# Altium schematic sheet Schema2_bakplan_Lynx.SchDoc
size B
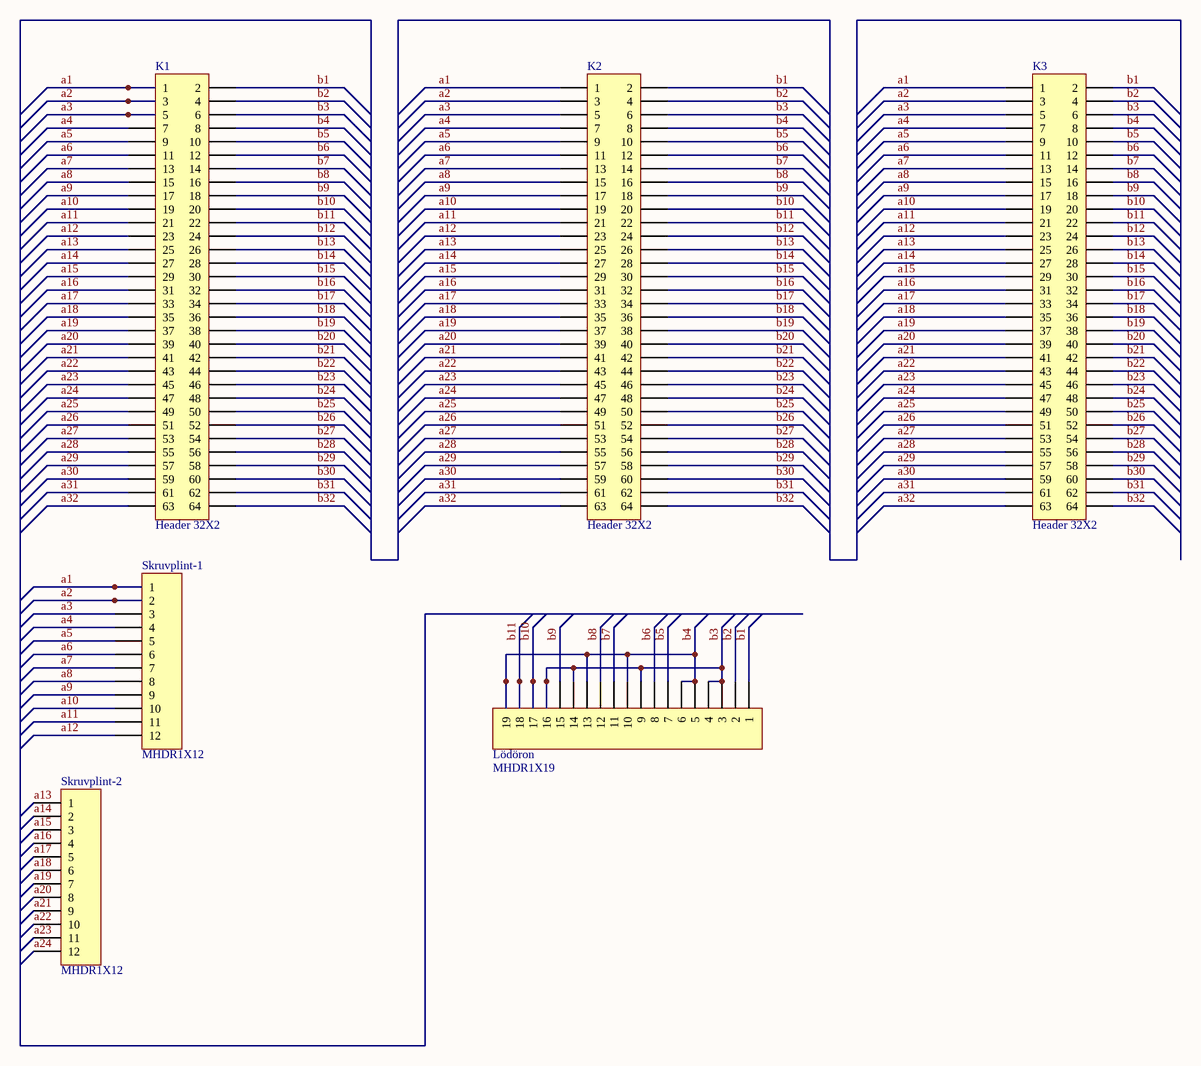
[diagram p0: Schema2_bakplan_Lynx.SchDoc]

## Parts
K1  Header 32X2  [DIN41612_EuropadonB64_Hyls]
K2  Header 32X2  [DIN41612_EuropadonB64_Hyls]
K3  Header 32X2  [DIN41612_EuropadonB64_Hyls]
Lödöron  MHDR1X19  [Lödöron_19]
Skruvplint-1  MHDR1X12  [Plint12]
Skruvplint-2  MHDR1X12  [Plint12]

## Nets
a1: K1.1 K2.1 K3.1 Skruvplint-1.1
a2: K1.3 K2.3 K3.3 Skruvplint-1.2
a3: K1.5 K2.5 K3.5 Skruvplint-1.3
a4: K1.7 K2.7 K3.7 Skruvplint-1.4
a5: K1.9 K2.9 K3.9 Skruvplint-1.5
a6: K1.11 K2.11 K3.11 Skruvplint-1.6
a7: K1.13 K2.13 K3.13 Skruvplint-1.7
a8: K1.15 K2.15 K3.15 Skruvplint-1.8
a9: K1.17 K2.17 K3.17 Skruvplint-1.9
a10: K1.19 K2.19 K3.19 Skruvplint-1.10
a11: K1.21 K2.21 K3.21 Skruvplint-1.11
a12: K1.23 K2.23 K3.23 Skruvplint-1.12
a13: K1.25 K2.25 K3.25 Skruvplint-2.1
a14: K1.27 K2.27 K3.27 Skruvplint-2.2
a15: K1.29 K2.29 K3.29 Skruvplint-2.3
a16: K1.31 K2.31 K3.31 Skruvplint-2.4
a17: K1.33 K2.33 K3.33 Skruvplint-2.5
a18: K1.35 K2.35 K3.35 Skruvplint-2.6
a19: K1.37 K2.37 K3.37 Skruvplint-2.7
a20: K1.39 K2.39 K3.39 Skruvplint-2.8
a21: K1.41 K2.41 K3.41 Skruvplint-2.9
a22: K1.43 K2.43 K3.43 Skruvplint-2.10
a23: K1.45 K2.45 K3.45 Skruvplint-2.11
a24: K1.47 K2.47 K3.47 Skruvplint-2.12
a25: K1.49 K2.49 K3.49
a26: K1.51 K2.51 K3.51
a27: K1.53 K2.53 K3.53
a28: K1.55 K2.55 K3.55
a29: K1.57 K2.57 K3.57
a30: K1.59 K2.59 K3.59
a31: K1.61 K2.61 K3.61
a32: K1.63 K2.63 K3.63
b1: K1.2 K2.2 K3.2 Lödöron.1
b2: K1.4 K2.4 K3.4 Lödöron.2
b3: K1.6 K2.6 K3.6 Lödöron.3 Lödöron.4 Lödöron.9 Lödöron.14 Lödöron.16
b4: K1.8 K2.8 K3.8 Lödöron.5 Lödöron.6 Lödöron.10 Lödöron.13 Lödöron.19
b5: K1.10 K2.10 K3.10 Lödöron.7
b6: K1.12 K2.12 K3.12 Lödöron.8
b7: K1.14 K2.14 K3.14 Lödöron.11
b8: K1.16 K2.16 K3.16 Lödöron.12
b9: K1.18 K2.18 K3.18 Lödöron.15
b10: K1.20 K2.20 K3.20 Lödöron.17
b11: K1.22 K2.22 K3.22 Lödöron.18
b12: K1.24 K2.24 K3.24
b13: K1.26 K2.26 K3.26
b14: K1.28 K2.28 K3.28
b15: K1.30 K2.30 K3.30
b16: K1.32 K2.32 K3.32
b17: K1.34 K2.34 K3.34
b18: K1.36 K2.36 K3.36
b19: K1.38 K2.38 K3.38
b20: K1.40 K2.40 K3.40
b21: K1.42 K2.42 K3.42
b22: K1.44 K2.44 K3.44
b23: K1.46 K2.46 K3.46
b24: K1.48 K2.48 K3.48
b25: K1.50 K2.50 K3.50
b26: K1.52 K2.52 K3.52
b27: K1.54 K2.54 K3.54
b28: K1.56 K2.56 K3.56
b29: K1.58 K2.58 K3.58
b30: K1.60 K2.60 K3.60
b31: K1.62 K2.62 K3.62
b32: K1.64 K2.64 K3.64

## Library data of the parts
K1-K3 = Header 30X2: Header, 30-Pin, Dual row; Manufacturer: Generic Components; Class I: Connector; Revision: July-2002: Re-released for DXP Platform.; Publisher: Altium Limited
Lödöron = MHDR1X19: Header, 19-Pin; Manufacturer: Generic Components; Class I: Connector; Revision: July-2002: Re-released for DXP Platform.; Publisher: Altium Limited
Skruvplint-1 Skruvplint-2 = MHDR1X12: Header, 12-Pin; Manufacturer: Generic Components; Class I: Connector; Revision: July-2002: Re-released for DXP Platform.; Publisher: Altium Limited